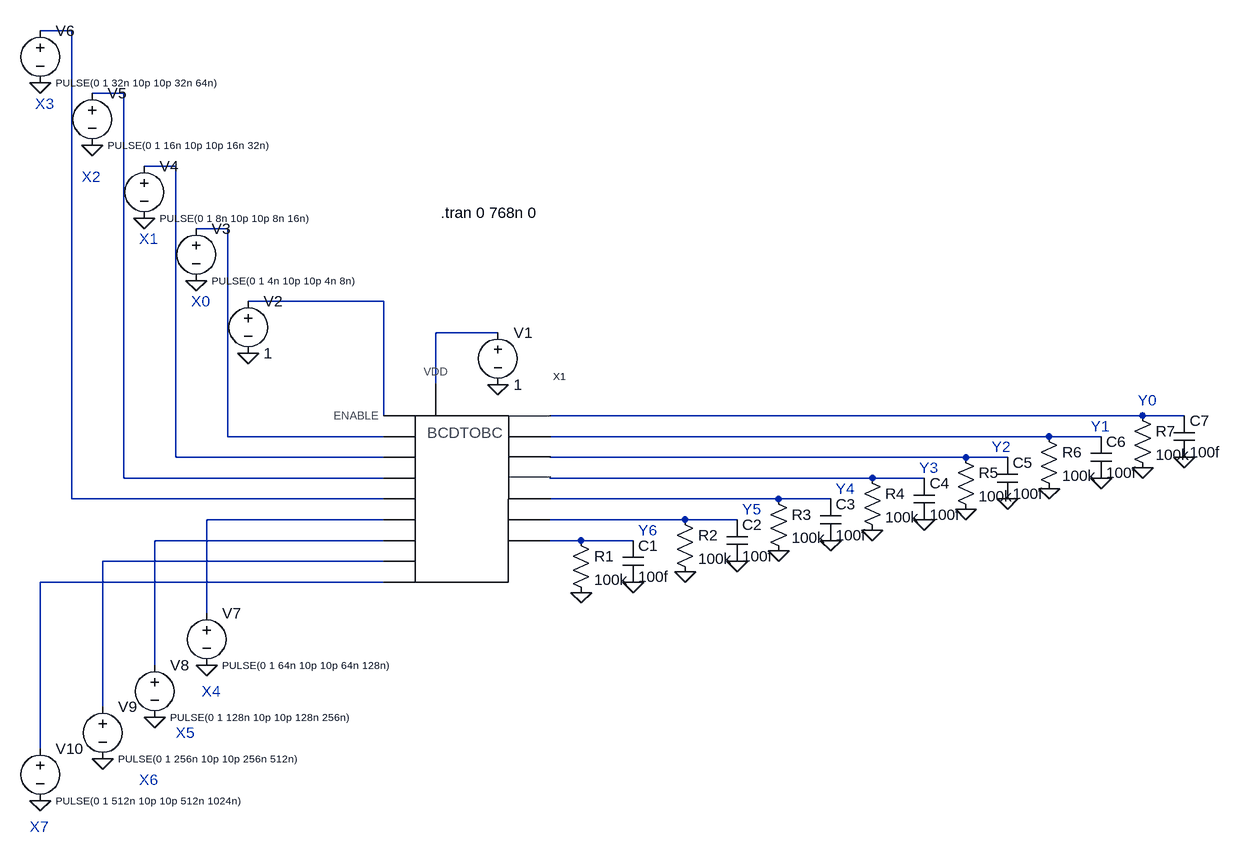
[diagram p0: schematic Final Test.asc]
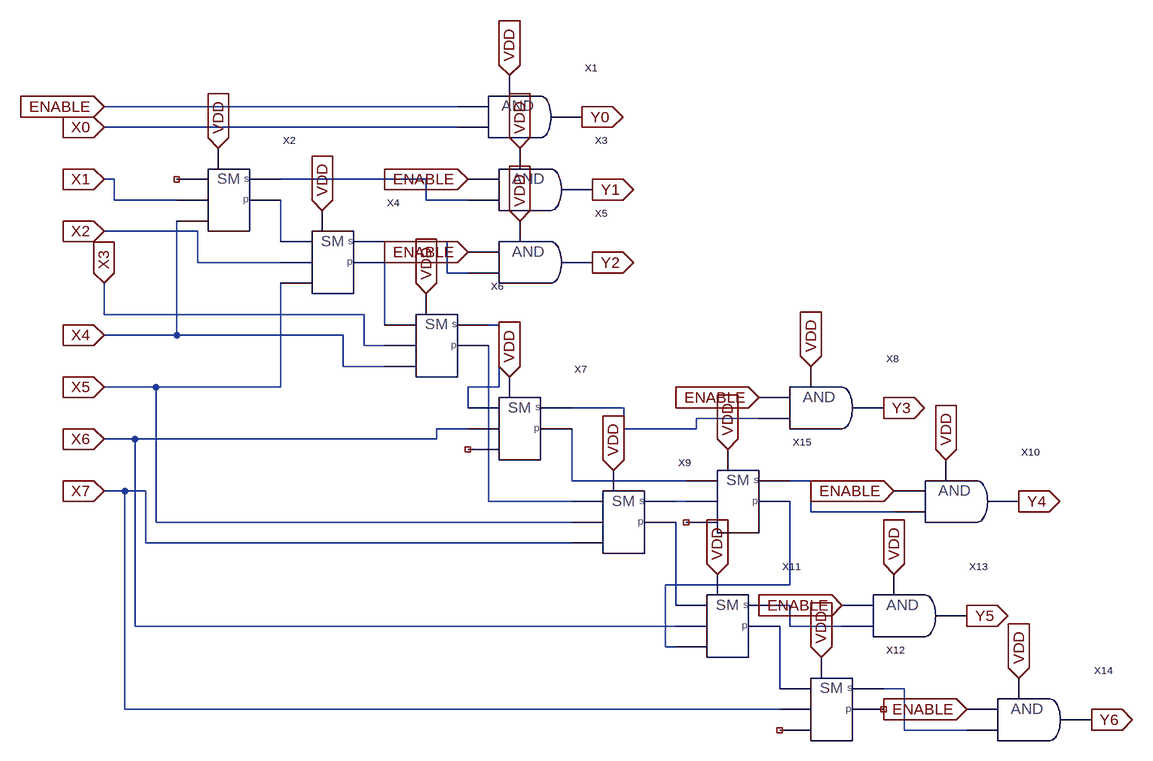
[diagram p1: sub-circuit bcdconverter.asc]
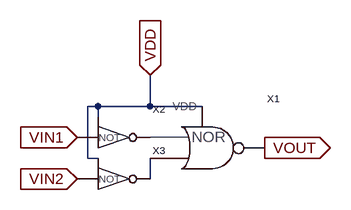
[diagram p2: sub-circuit and.asc]
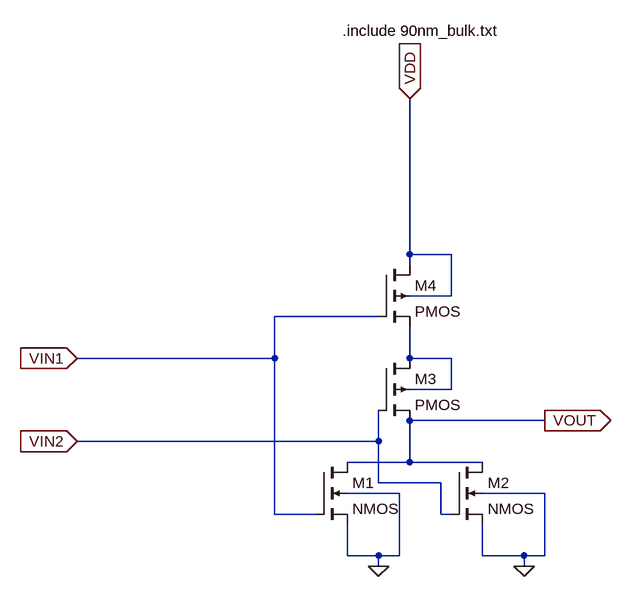
[diagram p3: sub-circuit nor.asc]
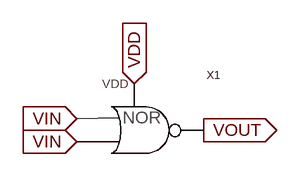
[diagram p4: sub-circuit not.asc]
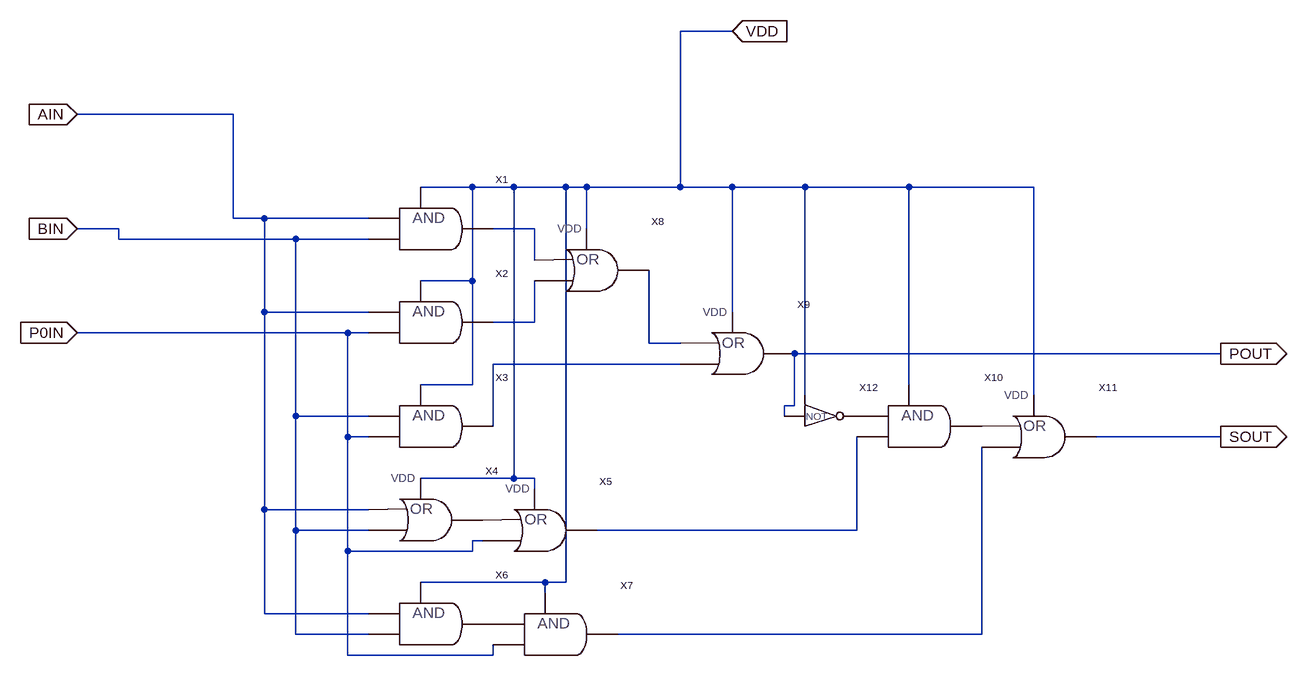
[diagram p5: sub-circuit sum.asc]
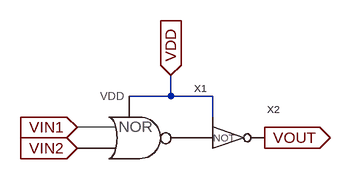
[diagram p6: sub-circuit or.asc]
Final Test.asc, the LTspice schematic file:
Version 4
SHEET 1 1376 728
WIRE -400 -512 -448 -512
WIRE -320 -416 -368 -416
WIRE -240 -304 -288 -304
WIRE -160 -208 -208 -208
WIRE 80 -96 -128 -96
WIRE 256 -48 160 -48
WIRE 160 32 160 -48
WIRE 80 80 80 -96
WIRE 1248 80 336 80
WIRE 1312 80 1248 80
WIRE -160 112 -160 -208
WIRE 80 112 -160 112
WIRE 1104 112 336 112
WIRE 1184 112 1104 112
WIRE -240 144 -240 -304
WIRE 80 144 -240 144
WIRE 976 144 336 144
WIRE 1040 144 976 144
WIRE -320 176 -320 -416
WIRE 80 176 -320 176
WIRE 832 176 336 176
WIRE 912 176 832 176
WIRE -400 208 -400 -512
WIRE 80 208 -400 208
WIRE 688 208 336 208
WIRE 768 208 688 208
WIRE 80 240 -192 240
WIRE 544 240 336 240
WIRE 624 240 544 240
WIRE 80 272 -272 272
WIRE 384 272 336 272
WIRE 464 272 384 272
WIRE 80 304 -352 304
WIRE 80 336 -448 336
WIRE -192 384 -192 240
WIRE -272 464 -272 272
WIRE -352 528 -352 304
WIRE -448 592 -448 336
FLAG 256 32 0
FLAG -128 -16 0
FLAG -208 -128 0
FLAG -288 -224 0
FLAG -368 -336 0
FLAG -448 -432 0
FLAG -192 464 0
FLAG -272 544 0
FLAG -352 608 0
FLAG -448 672 0
FLAG 1312 144 0
FLAG 1248 160 0
FLAG 1184 176 0
FLAG 1104 192 0
FLAG 1040 208 0
FLAG 976 224 0
FLAG 912 240 0
FLAG 832 256 0
FLAG 768 272 0
FLAG 688 288 0
FLAG 624 304 0
FLAG 544 320 0
FLAG 464 336 0
FLAG 384 352 0
SYMBOL BCDCONVERTER 176 144 R0
SYMATTR InstName X1
SYMBOL voltage 256 -64 R0
WINDOW 123 0 0 Left 0
WINDOW 39 0 0 Left 0
SYMATTR InstName V1
SYMATTR Value 1
SYMBOL voltage -128 -112 R0
WINDOW 123 0 0 Left 0
WINDOW 39 0 0 Left 0
SYMATTR InstName V2
SYMATTR Value 1
SYMBOL voltage -208 -224 R0
WINDOW 123 0 0 Left 0
WINDOW 39 0 0 Left 0
WINDOW 3 24 96 Left 1
SYMATTR Value PULSE(0 1 4n 10p 10p 4n 8n)
SYMATTR InstName V3
SYMBOL voltage -288 -320 R0
WINDOW 123 0 0 Left 0
WINDOW 39 0 0 Left 0
WINDOW 3 24 96 Left 1
SYMATTR Value PULSE(0 1 8n 10p 10p 8n 16n)
SYMATTR InstName V4
SYMBOL voltage -368 -432 R0
WINDOW 123 0 0 Left 0
WINDOW 39 0 0 Left 0
WINDOW 3 24 96 Left 1
SYMATTR Value PULSE(0 1 16n 10p 10p 16n 32n)
SYMATTR InstName V5
SYMBOL voltage -448 -528 R0
WINDOW 123 0 0 Left 0
WINDOW 39 0 0 Left 0
WINDOW 3 24 96 Left 1
SYMATTR Value PULSE(0 1 32n 10p 10p 32n 64n)
SYMATTR InstName V6
SYMBOL voltage -192 368 R0
WINDOW 123 0 0 Left 0
WINDOW 39 0 0 Left 0
WINDOW 3 24 96 Left 1
SYMATTR Value PULSE(0 1 64n 10p 10p 64n 128n)
SYMATTR InstName V7
SYMBOL voltage -272 448 R0
WINDOW 123 0 0 Left 0
WINDOW 39 0 0 Left 0
WINDOW 3 24 96 Left 1
SYMATTR Value PULSE(0 1 128n 10p 10p 128n 256n)
SYMATTR InstName V8
SYMBOL voltage -352 512 R0
WINDOW 123 0 0 Left 0
WINDOW 39 0 0 Left 0
WINDOW 3 24 96 Left 1
SYMATTR Value PULSE(0 1 256n 10p 10p 256n 512n)
SYMATTR InstName V9
SYMBOL voltage -448 576 R0
WINDOW 123 0 0 Left 0
WINDOW 39 0 0 Left 0
WINDOW 3 24 96 Left 1
SYMATTR Value PULSE(0 1 512n 10p 10p 512n 1024n)
SYMATTR InstName V10
SYMBOL res 368 256 R0
SYMATTR InstName R1
SYMATTR Value 100k
SYMBOL cap 448 272 R0
SYMATTR InstName C1
SYMATTR Value 100f
SYMBOL res 528 224 R0
SYMATTR InstName R2
SYMATTR Value 100k
SYMBOL cap 608 240 R0
SYMATTR InstName C2
SYMATTR Value 100f
SYMBOL res 672 192 R0
SYMATTR InstName R3
SYMATTR Value 100k
SYMBOL cap 752 208 R0
SYMATTR InstName C3
SYMATTR Value 100f
SYMBOL res 816 160 R0
SYMATTR InstName R4
SYMATTR Value 100k
SYMBOL cap 896 176 R0
SYMATTR InstName C4
SYMATTR Value 100f
SYMBOL res 960 128 R0
SYMATTR InstName R5
SYMATTR Value 100k
SYMBOL cap 1024 144 R0
SYMATTR InstName C5
SYMATTR Value 100f
SYMBOL res 1088 96 R0
SYMATTR InstName R6
SYMATTR Value 100k
SYMBOL cap 1168 112 R0
SYMATTR InstName C6
SYMATTR Value 100f
SYMBOL res 1232 64 R0
SYMATTR InstName R7
SYMATTR Value 100k
SYMBOL cap 1296 80 R0
SYMATTR InstName C7
SYMATTR Value 100f
TEXT 168 -232 Left 2 !.tran 0 768n 0
TEXT -216 -96 Left 2 ;X0
TEXT -296 -192 Left 2 ;X1
TEXT -384 -288 Left 2 ;X2
TEXT -456 -400 Left 2 ;X3
TEXT -200 504 Left 2 ;X4
TEXT -240 568 Left 2 ;X5
TEXT -296 640 Left 2 ;X6
TEXT -464 712 Left 2 ;X7
TEXT 1240 56 Left 2 ;Y0
TEXT 1168 96 Left 2 ;Y1
TEXT 1016 128 Left 2 ;Y2
TEXT 904 160 Left 2 ;Y3
TEXT 776 192 Left 2 ;Y4
TEXT 632 224 Left 2 ;Y5
TEXT 472 256 Left 2 ;Y6

bcdconverter.asc, the sub-circuit schematic file:
Version 4
SHEET 1 1444 1144
WIRE 256 128 -288 128
WIRE 256 160 -288 160
WIRE -272 240 -288 240
WIRE 208 240 -16 240
WIRE -272 272 -272 240
WIRE -176 272 -272 272
WIRE 208 272 208 240
WIRE 272 272 208 272
WIRE -144 320 -288 320
WIRE -16 336 -16 272
WIRE 240 336 144 336
WIRE -144 368 -144 320
WIRE -16 368 -144 368
WIRE 240 384 240 336
WIRE 272 384 240 384
WIRE -288 448 -288 400
WIRE 112 448 -288 448
WIRE 144 464 144 368
WIRE 320 464 304 464
WIRE -176 480 -176 304
WIRE -176 480 -288 480
WIRE 80 480 -176 480
WIRE 112 496 112 448
WIRE 144 496 112 496
WIRE 80 528 80 480
WIRE 144 528 80 528
WIRE -208 560 -288 560
WIRE -16 560 -16 400
WIRE -16 560 -208 560
WIRE 320 560 320 464
WIRE 320 560 272 560
WIRE 272 592 272 560
WIRE 512 592 432 592
WIRE 720 608 624 608
WIRE 272 624 224 624
WIRE 512 624 512 592
WIRE 624 624 624 608
WIRE 624 624 512 624
WIRE -240 640 -288 640
WIRE 224 640 224 624
WIRE 224 640 -240 640
WIRE 432 704 432 624
WIRE 608 704 432 704
WIRE 800 704 768 704
WIRE -256 720 -288 720
WIRE -224 720 -256 720
WIRE 304 736 304 496
WIRE 432 736 304 736
WIRE 608 736 592 736
WIRE 800 752 800 704
WIRE 928 752 800 752
WIRE -208 768 -208 560
WIRE 432 768 -208 768
WIRE -224 800 -224 720
WIRE 432 800 -224 800
WIRE 768 864 768 736
WIRE 768 864 576 864
WIRE 592 896 592 768
WIRE 768 896 752 896
WIRE -240 928 -240 640
WIRE 592 928 -240 928
WIRE 768 928 768 896
WIRE 848 928 768 928
WIRE 576 960 576 864
WIRE 592 960 576 960
WIRE 752 1024 752 928
WIRE 944 1024 912 1024
WIRE -256 1056 -256 720
WIRE 752 1056 -256 1056
WIRE 944 1088 944 1024
WIRE 1040 1088 944 1088
FLAG -288 128 ENABLE
IOPIN -288 128 In
FLAG -288 160 X0
IOPIN -288 160 In
FLAG -288 240 X1
IOPIN -288 240 In
FLAG -288 320 X2
IOPIN -288 320 In
FLAG -288 400 X3
IOPIN -288 400 In
FLAG -288 480 X4
IOPIN -288 480 In
FLAG -288 560 X5
IOPIN -288 560 In
FLAG -288 640 X6
IOPIN -288 640 In
FLAG -288 720 X7
IOPIN -288 720 In
FLAG 448 144 Y0
IOPIN 448 144 Out
FLAG 464 256 Y1
IOPIN 464 256 Out
FLAG 464 368 Y2
IOPIN 464 368 Out
FLAG 912 592 Y3
IOPIN 912 592 Out
FLAG 1120 736 Y4
IOPIN 1120 736 Out
FLAG 1040 912 Y5
IOPIN 1040 912 Out
FLAG 1232 1072 Y6
IOPIN 1232 1072 Out
FLAG 272 240 ENABLE
IOPIN 272 240 In
FLAG 272 352 ENABLE
IOPIN 272 352 In
FLAG 720 576 ENABLE
IOPIN 720 576 In
FLAG 928 720 ENABLE
IOPIN 928 720 In
FLAG 848 896 ENABLE
IOPIN 848 896 In
FLAG 1040 1056 ENABLE
IOPIN 1040 1056 In
FLAG 336 80 VDD
IOPIN 336 80 In
FLAG 352 192 VDD
IOPIN 352 192 In
FLAG 352 304 VDD
IOPIN 352 304 In
FLAG 800 528 VDD
IOPIN 800 528 In
FLAG 1008 672 VDD
IOPIN 1008 672 In
FLAG 928 848 VDD
IOPIN 928 848 In
FLAG 1120 1008 VDD
IOPIN 1120 1008 In
FLAG 816 976 VDD
IOPIN 816 976 In
FLAG 656 848 VDD
IOPIN 656 848 In
FLAG 496 688 VDD
IOPIN 496 688 In
FLAG 336 544 VDD
IOPIN 336 544 In
FLAG 208 416 VDD
IOPIN 208 416 In
FLAG 48 288 VDD
IOPIN 48 288 In
FLAG -112 192 VDD
IOPIN -112 192 In
FLAG 672 656 VDD
IOPIN 672 656 In
SYMBOL AND 336 144 R0
SYMATTR InstName X1
SYMBOL SUM -96 256 R0
SYMATTR InstName X2
SYMBOL AND 352 256 R0
SYMATTR InstName X3
SYMBOL SUM 64 352 R0
SYMATTR InstName X4
SYMBOL AND 352 368 R0
SYMATTR InstName X5
SYMBOL SUM 224 480 R0
SYMATTR InstName X6
SYMBOL SUM 352 608 R0
SYMATTR InstName X7
SYMBOL AND 800 592 R0
SYMATTR InstName X8
SYMBOL SUM 512 752 R0
SYMATTR InstName X9
SYMBOL AND 1008 736 R0
SYMATTR InstName X10
SYMBOL SUM 672 912 R0
SYMATTR InstName X11
SYMBOL SUM 832 1040 R0
SYMATTR InstName X12
SYMBOL AND 928 912 R0
SYMATTR InstName X13
SYMBOL AND 1120 1072 R0
SYMATTR InstName X14
SYMBOL SUM 688 720 R0
SYMATTR InstName X15

and.asc, the sub-circuit schematic file:
Version 4
SHEET 1 880 680
WIRE 48 96 32 96
WIRE 128 96 128 48
WIRE 128 96 48 96
WIRE 208 96 128 96
WIRE 48 112 48 96
WIRE 32 176 32 96
WIRE 48 176 32 176
WIRE 128 208 128 176
FLAG 16 144 VIN1
IOPIN 16 144 In
FLAG 16 208 VIN2
IOPIN 16 208 In
FLAG 128 48 VDD
IOPIN 128 48 In
FLAG 304 160 VOUT
IOPIN 304 160 Out
SYMBOL NOR 208 160 R0
SYMATTR InstName X1
SYMBOL NOT 80 144 R0
SYMATTR InstName X2
SYMBOL NOT 80 208 R0
SYMATTR InstName X3

nor.asc, the sub-circuit schematic file:
Version 4
SHEET 1 880 680
WIRE 336 -32 336 -272
WIRE 400 -32 336 -32
WIRE 336 -16 336 -32
WIRE 400 32 400 -32
WIRE 400 32 336 32
WIRE 288 64 128 64
WIRE 128 128 128 64
WIRE 128 128 -176 128
WIRE 336 128 336 80
WIRE 400 128 336 128
WIRE 400 176 400 128
WIRE 400 176 336 176
WIRE 336 224 336 208
WIRE 544 224 336 224
WIRE 288 256 288 208
WIRE 288 256 -176 256
WIRE 336 288 336 224
WIRE 336 288 240 288
WIRE 448 288 336 288
WIRE 288 320 288 256
WIRE 384 320 288 320
WIRE 320 336 240 336
WIRE 544 336 448 336
WIRE 128 368 128 128
WIRE 192 368 128 368
WIRE 384 368 384 320
WIRE 400 368 384 368
WIRE 240 432 240 384
WIRE 288 432 240 432
WIRE 320 432 320 336
WIRE 320 432 288 432
WIRE 448 432 448 384
WIRE 512 432 448 432
WIRE 544 432 544 336
WIRE 544 432 512 432
WIRE 288 448 288 432
WIRE 512 448 512 432
FLAG 288 448 0
FLAG 512 448 0
FLAG 544 224 VOUT
IOPIN 544 224 Out
FLAG -176 128 VIN1
IOPIN -176 128 In
FLAG -176 256 VIN2
IOPIN -176 256 In
FLAG 336 -272 VDD
IOPIN 336 -272 In
SYMBOL nmos4 192 288 R0
SYMATTR InstName M1
SYMATTR Value2 l=90n w=200n
SYMBOL nmos4 400 288 R0
SYMATTR InstName M2
SYMATTR Value2 l=90n w=200n
SYMBOL pmos4 288 128 R0
SYMATTR InstName M3
SYMATTR Value2 l=90n w=400n
SYMBOL pmos4 288 -16 R0
SYMATTR InstName M4
SYMATTR Value2 l=90n w=400n
TEXT 232 -376 Left 2 !.include 90nm_bulk.txt

not.asc, the sub-circuit schematic file:
Version 4
SHEET 1 880 680
FLAG 112 176 VIN
IOPIN 112 176 In
FLAG 112 208 VIN
IOPIN 112 208 In
FLAG 288 192 VOUT
IOPIN 288 192 Out
FLAG 192 128 VDD
IOPIN 192 128 In
SYMBOL NOR 192 192 R0
SYMATTR InstName X1

sum.asc, the sub-circuit schematic file:
Version 4
SHEET 1 1532 772
WIRE 656 -192 576 -192
WIRE -112 -64 -352 -64
WIRE 256 48 176 48
WIRE 320 48 256 48
WIRE 400 48 320 48
WIRE 432 48 400 48
WIRE 576 48 576 -192
WIRE 576 48 432 48
WIRE 656 48 576 48
WIRE 768 48 656 48
WIRE 928 48 768 48
WIRE 1120 48 928 48
WIRE -112 96 -112 -64
WIRE -64 96 -112 96
WIRE 96 96 -64 96
WIRE -288 112 -352 112
WIRE 352 112 288 112
WIRE 432 112 432 48
WIRE -288 128 -288 112
WIRE -16 128 -288 128
WIRE 96 128 -16 128
WIRE 352 160 352 112
WIRE 256 192 256 48
WIRE 256 192 176 192
WIRE -64 240 -64 96
WIRE 96 240 -64 240
WIRE 656 240 656 48
WIRE 352 256 352 192
WIRE 352 256 288 256
WIRE 64 272 -352 272
WIRE 96 272 64 272
WIRE 528 288 528 176
WIRE 576 288 528 288
WIRE 1408 304 752 304
WIRE 576 320 288 320
WIRE 256 352 256 192
WIRE 256 352 176 352
WIRE 928 352 928 48
WIRE 768 368 768 48
WIRE 1120 368 1120 48
WIRE 752 384 752 304
WIRE 752 384 736 384
WIRE -16 400 -16 128
WIRE 96 400 -16 400
WIRE 736 400 736 384
WIRE 288 416 288 320
WIRE 64 432 64 272
WIRE 96 432 64 432
WIRE 1408 432 1216 432
WIRE 320 496 320 48
WIRE 320 496 176 496
WIRE 352 496 320 496
WIRE 352 512 352 496
WIRE -64 544 -64 240
WIRE 96 544 -64 544
WIRE -16 576 -16 400
WIRE 96 576 -16 576
WIRE 848 576 848 432
WIRE 848 576 448 576
WIRE 272 592 256 592
WIRE 64 608 64 432
WIRE 256 608 256 592
WIRE 256 608 64 608
WIRE 368 656 176 656
WIRE 400 656 400 48
WIRE 400 656 368 656
WIRE 368 672 368 656
WIRE -64 704 -64 544
WIRE 96 704 -64 704
WIRE -16 736 -16 576
WIRE 96 736 -16 736
WIRE 1040 736 1040 448
WIRE 1040 736 480 736
WIRE 64 768 64 608
WIRE 288 768 288 752
WIRE 288 768 64 768
FLAG 1408 304 POUT
IOPIN 1408 304 Out
FLAG 1408 432 SOUT
IOPIN 1408 432 Out
FLAG 656 -192 VDD
IOPIN 656 -192 In
FLAG -352 -64 AIN
IOPIN -352 -64 In
FLAG -352 112 BIN
IOPIN -352 112 In
FLAG -352 272 P0IN
IOPIN -352 272 In
SYMBOL AND 176 112 R0
SYMATTR InstName X1
SYMBOL AND 176 256 R0
SYMATTR InstName X2
SYMBOL AND 176 416 R0
SYMATTR InstName X3
SYMBOL OR 176 560 R0
SYMATTR InstName X4
SYMBOL OR 352 576 R0
SYMATTR InstName X5
SYMBOL AND 176 720 R0
SYMATTR InstName X6
SYMBOL AND 368 736 R0
SYMATTR InstName X7
SYMBOL OR 432 176 R0
SYMATTR InstName X8
SYMBOL AND 928 416 R0
SYMATTR InstName X10
SYMBOL OR 1120 432 R0
SYMATTR InstName X11
SYMBOL OR 656 304 R0
SYMATTR InstName X9
SYMBOL NOT 800 400 R0
SYMATTR InstName X12

or.asc, the sub-circuit schematic file:
Version 4
SHEET 1 880 680
WIRE 256 96 256 64
WIRE 256 96 192 96
WIRE 320 96 256 96
WIRE 320 128 320 96
FLAG 112 144 VIN1
IOPIN 112 144 In
FLAG 112 176 VIN2
IOPIN 112 176 In
FLAG 256 64 VDD
IOPIN 256 64 In
FLAG 400 160 VOUT
IOPIN 400 160 Out
SYMBOL NOR 192 160 R0
SYMATTR InstName X1
SYMBOL NOT 352 160 R0
SYMATTR InstName X2

The netlist it stands for:
* Final Test.asc
XX1 N006 N005 N004 N003 N002 N001 N012 N014 N016 N017 N007 N008 N009 N010 N011 N013 N015 bcdconverter
V1 N006 0 1
V2 N005 0 1
V3 N004 0 PULSE(0 1 4n 10p 10p 4n 8n)
V4 N003 0 PULSE(0 1 8n 10p 10p 8n 16n)
V5 N002 0 PULSE(0 1 16n 10p 10p 16n 32n)
V6 N001 0 PULSE(0 1 32n 10p 10p 32n 64n)
V7 N012 0 PULSE(0 1 64n 10p 10p 64n 128n)
V8 N014 0 PULSE(0 1 128n 10p 10p 128n 256n)
V9 N016 0 PULSE(0 1 256n 10p 10p 256n 512n)
V10 N017 0 PULSE(0 1 512n 10p 10p 512n 1024n)
R1 N015 0 100k
C1 N015 0 100f
R2 N013 0 100k
C2 N013 0 100f
R3 N011 0 100k
C3 N011 0 100f
R4 N010 0 100k
C4 N010 0 100f
R5 N009 0 100k
C5 N009 0 100f
R6 N008 0 100k
C6 N008 0 100f
R7 N007 0 100k
C7 N007 0 100f

* block symbol definitions
.subckt bcdconverter VDD ENABLE X0 X1 X2 X3 X4 X5 X6 X7 Y0 Y1 Y2 Y3 Y4 Y5 Y6
XX1 VDD ENABLE X0 Y0 and
XX2 N002 N001 VDD NC_01 X1 X4 sum
XX3 VDD ENABLE N001 Y1 and
XX4 N004 N003 VDD N002 X2 X5 sum
XX5 VDD ENABLE N003 Y2 and
XX6 N009 N005 VDD N004 X3 X4 sum
XX7 N007 N006 VDD N005 X6 NC_02 sum
XX8 VDD ENABLE N006 Y3 and
XX9 N012 N010 VDD N009 X5 X7 sum
XX10 VDD ENABLE N008 Y4 and
XX11 N014 N013 VDD N012 X6 N011 sum
XX12 NC_03 N015 VDD N014 X7 NC_04 sum
XX13 VDD ENABLE N013 Y5 and
XX14 VDD ENABLE N015 Y6 and
XX15 N011 N008 VDD N007 N010 NC_05 sum
.ends bcdconverter

.subckt and VDD VIN1 VIN2 VOUT
XX1 P001 N001 VDD VOUT nor
XX2 VDD VIN1 P001 not
XX3 VDD VIN2 N001 not
.ends and

.subckt nor VIN1 VIN2 VDD VOUT
M1 VOUT VIN1 0 0 NMOS l=90n w=200n
M2 VOUT VIN2 0 0 NMOS l=90n w=200n
M3 N001 VIN2 VOUT N001 PMOS l=90n w=400n
M4 VDD VIN1 N001 VDD PMOS l=90n w=400n
.include 90nm_bulk.txt
.ends nor

.subckt not VDD VIN VOUT
XX1 VIN VIN VDD VOUT nor
.ends not

.subckt sum POUT SOUT VDD AIN BIN P0IN
XX1 VDD AIN BIN N001 and
XX2 VDD AIN P0IN N002 and
XX3 VDD BIN P0IN N004 and
XX4 AIN BIN VDD P001 or
XX5 P001 P0IN VDD N005 or
XX6 VDD AIN BIN P002 and
XX7 VDD P002 P0IN N006 and
XX8 N001 N002 VDD N003 or
XX10 VDD P003 N005 P004 and
XX11 P004 N006 VDD SOUT or
XX9 N003 N004 VDD POUT or
XX12 VDD POUT P003 not
.ends sum

.subckt or VIN1 VIN2 VDD VOUT
XX1 VIN1 VIN2 VDD P001 nor
XX2 VDD P001 VOUT not
.ends or

.model NMOS NMOS
.model PMOS PMOS
.lib standard.mos
.tran 0 768n 0
* X0
* X1
* X2
* X3
* X4
* X5
* X6
* X7
* Y0
* Y1
* Y2
* Y3
* Y4
* Y5
* Y6
.backanno
.end